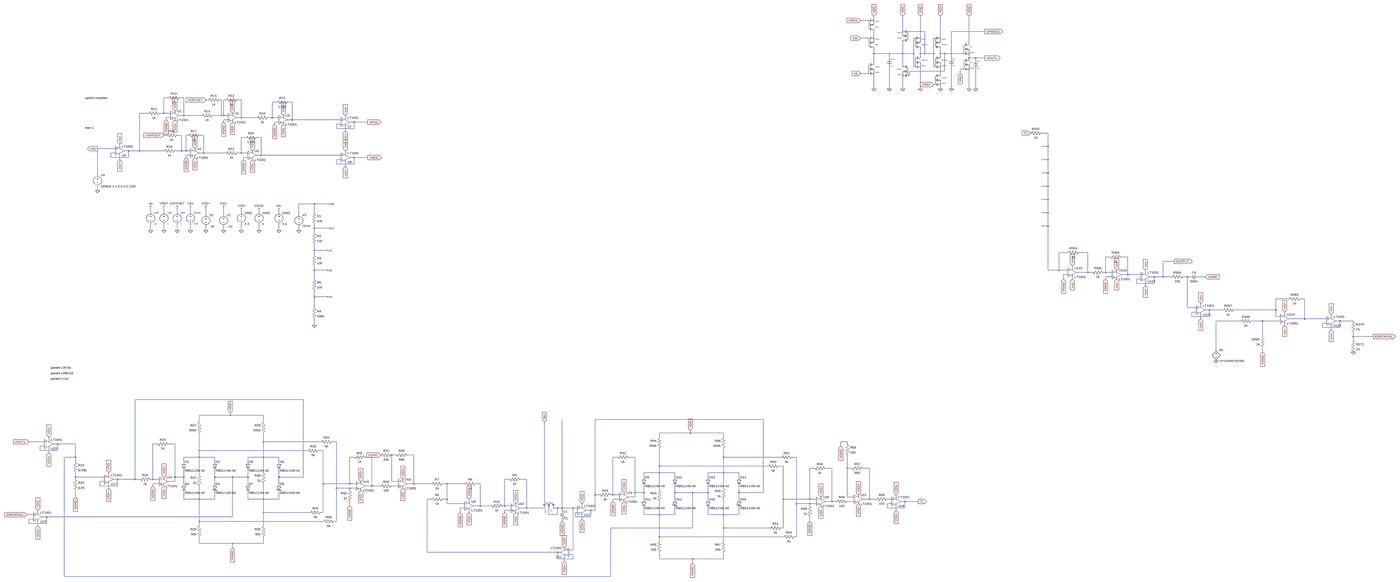
[diagram p0: schematic OZ_8_bounded_curves.asc, whole sheet]
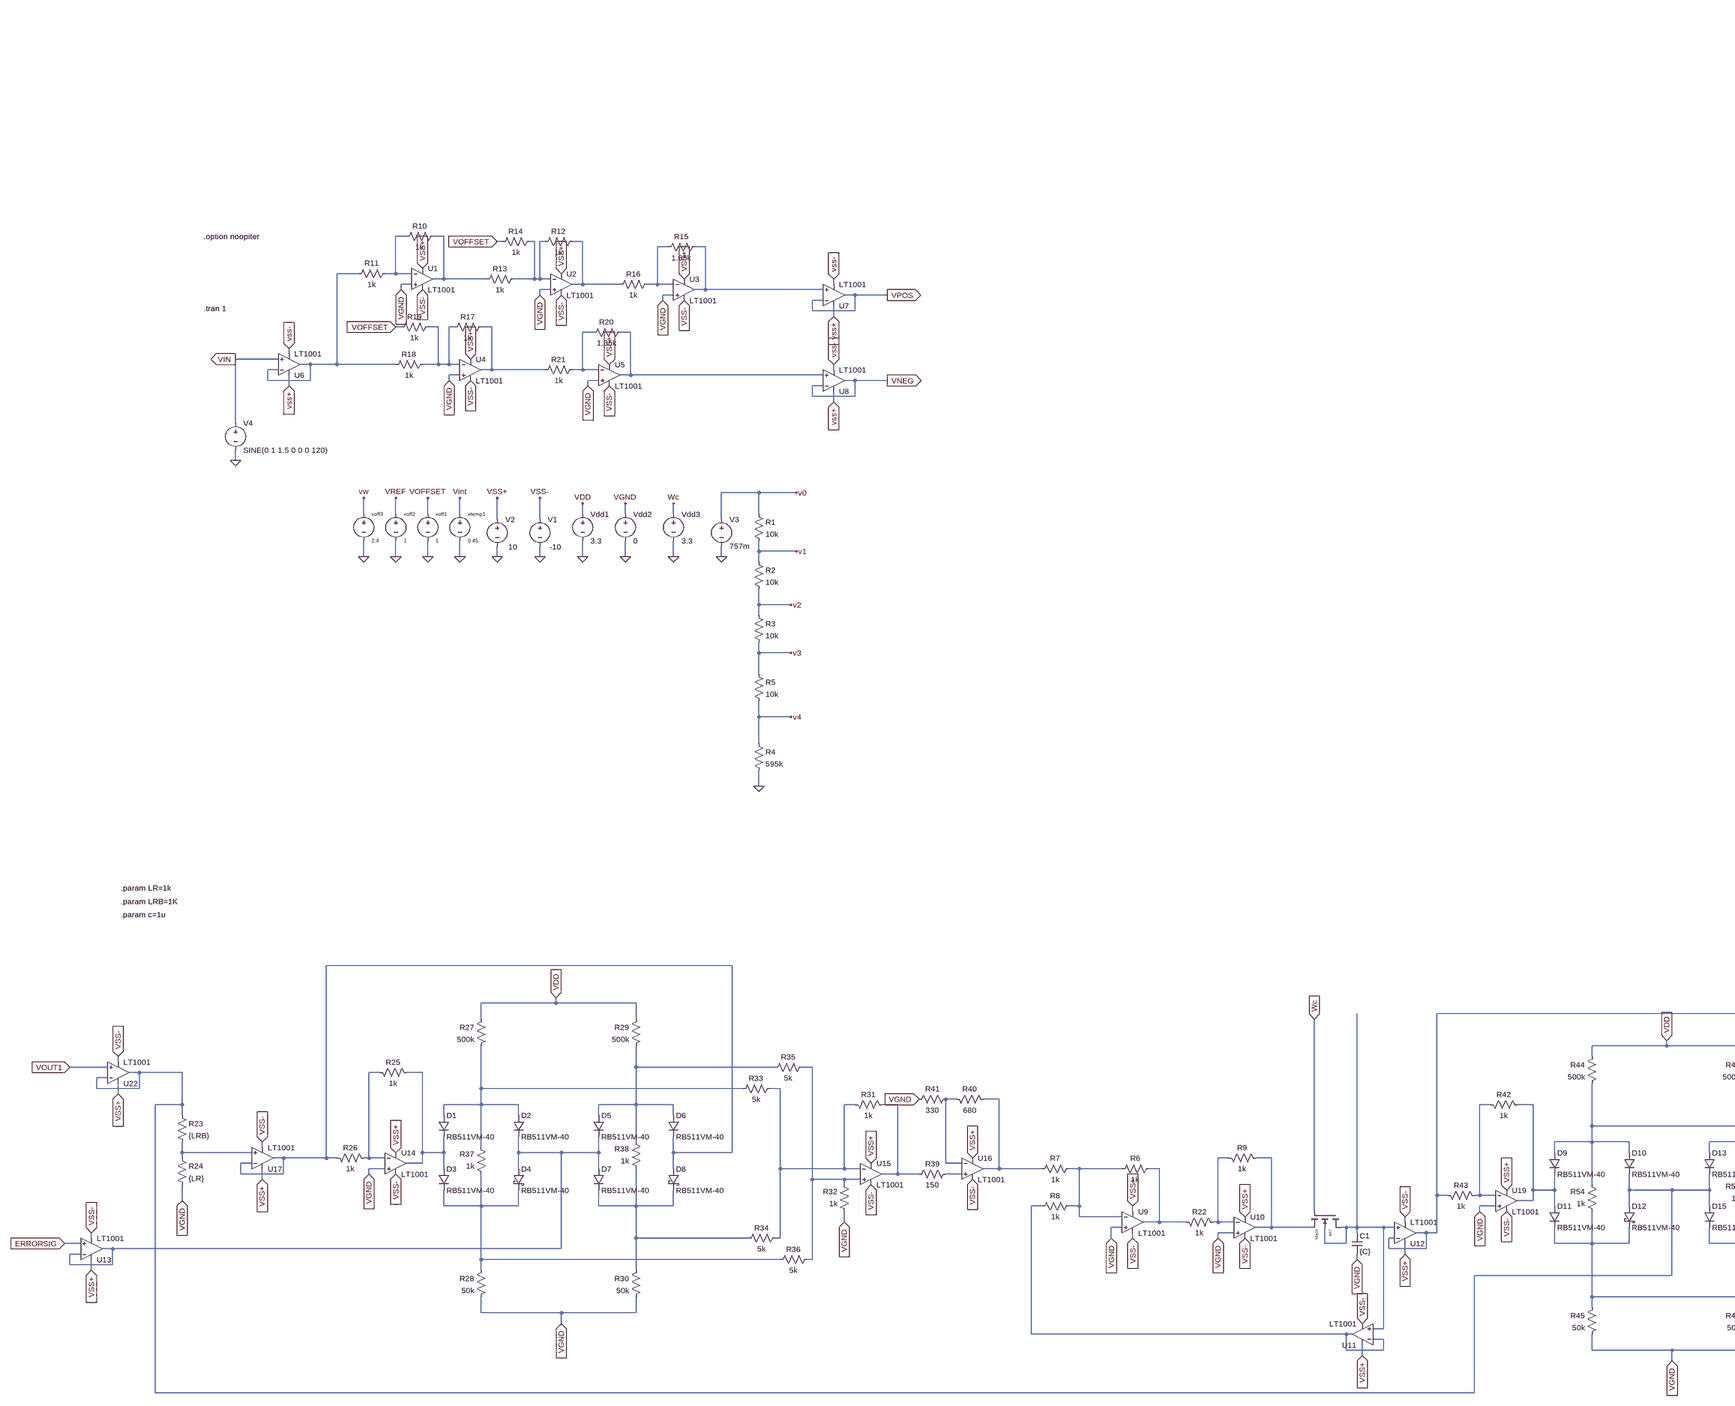
[diagram p1: schematic OZ_8_bounded_curves.asc, part, row 1 of 1, column 1 of 2]
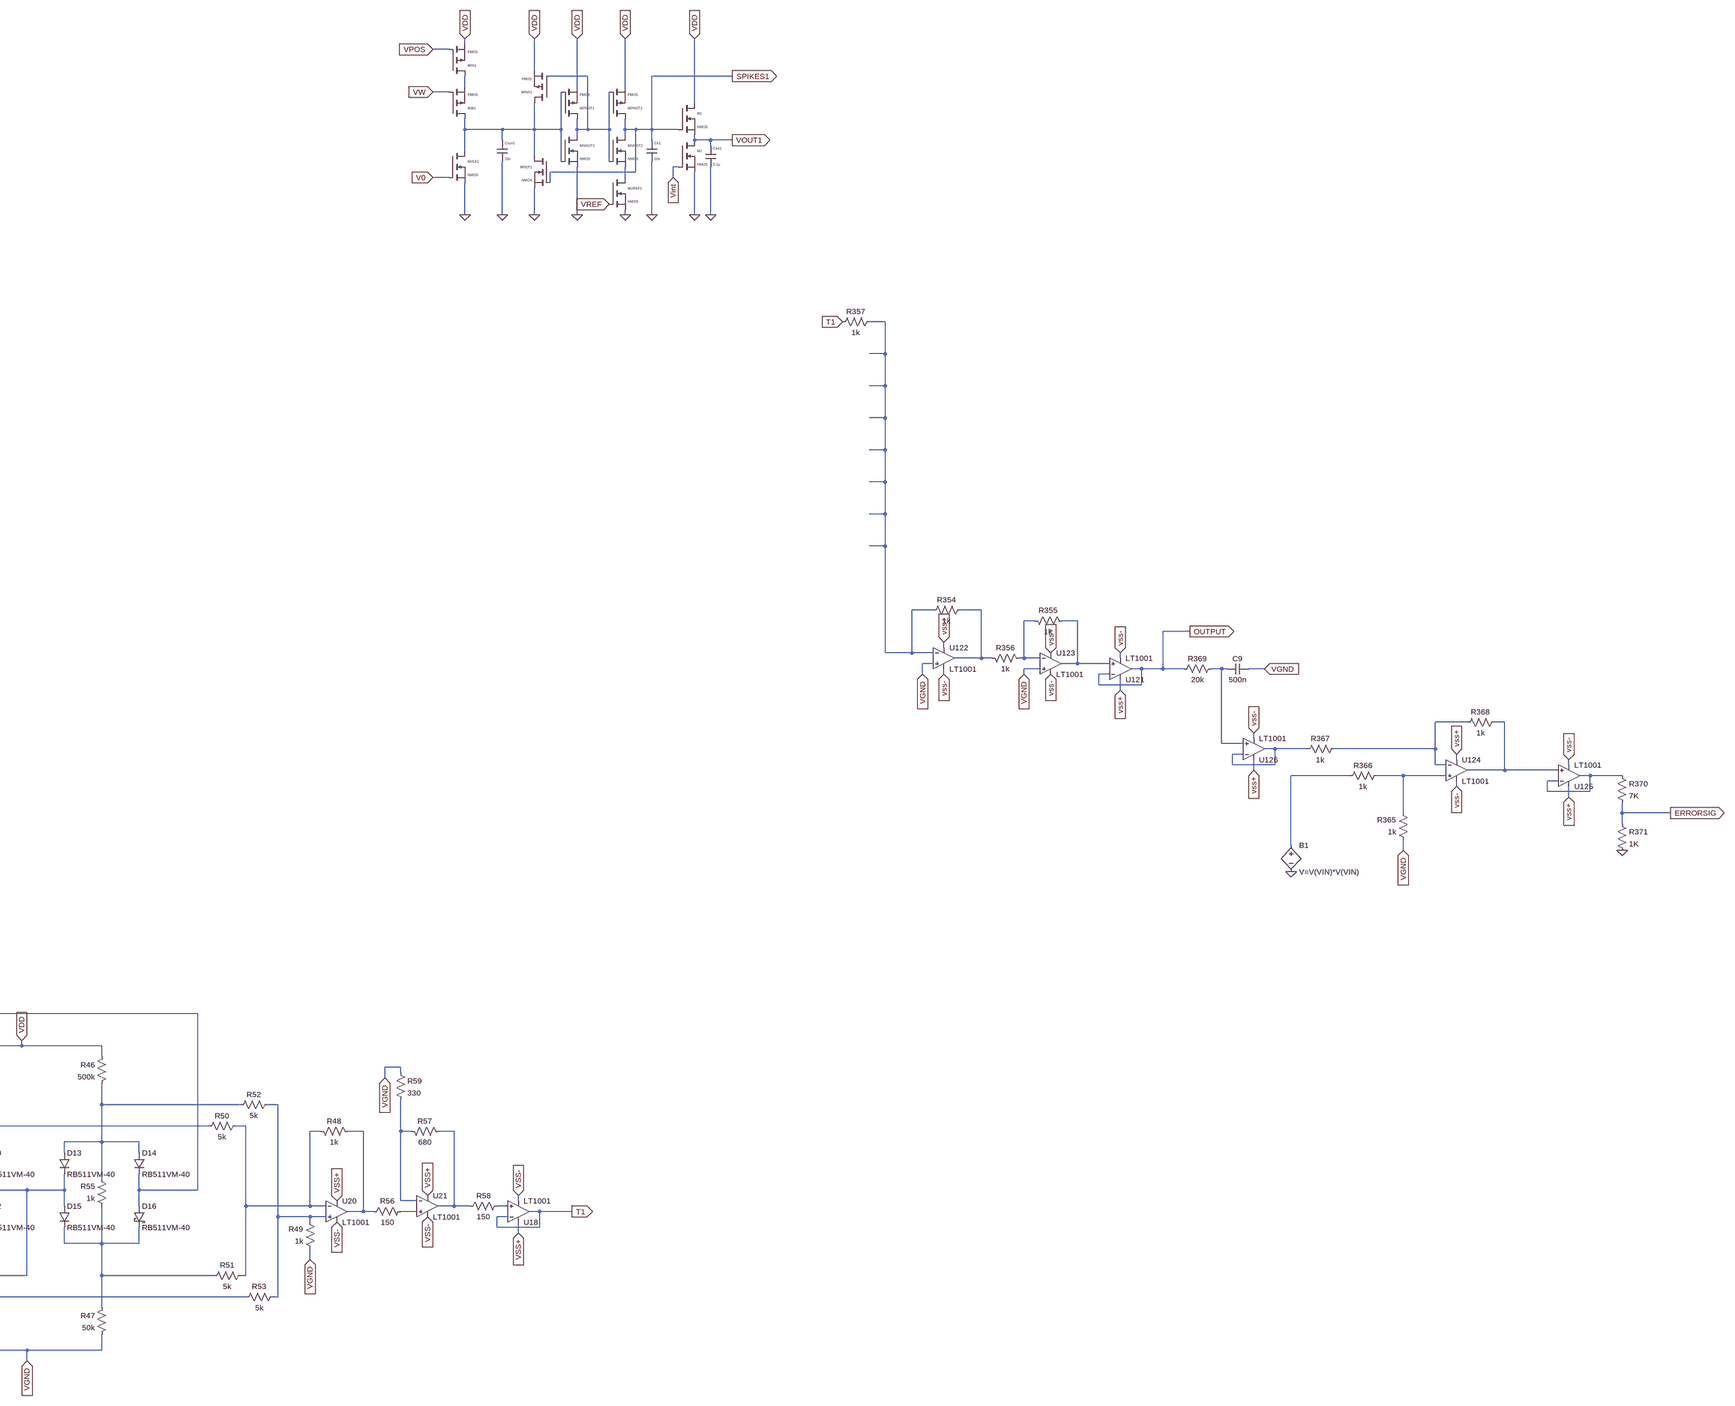
[diagram p2: schematic OZ_8_bounded_curves.asc, part, row 1 of 1, column 2 of 2]
OZ_8_bounded_curves.asc, the LTspice schematic file:
Version 4
SHEET 1 16040 10544
WIRE 5616 -832 5616 -848
WIRE 5568 -816 5520 -816
WIRE 5824 -752 5824 -848
WIRE 5984 -736 5872 -736
WIRE 6416 -736 6176 -736
WIRE 5616 -704 5616 -736
WIRE 5952 -704 5952 -848
WIRE 6096 -704 6096 -848
WIRE 5568 -688 5520 -688
WIRE 6304 -656 6304 -848
WIRE 5616 -576 5616 -608
WIRE 5728 -576 5616 -576
WIRE 5824 -576 5824 -656
WIRE 5824 -576 5728 -576
WIRE 5904 -576 5904 -688
WIRE 5904 -576 5824 -576
WIRE 5952 -576 5952 -608
WIRE 5984 -576 5984 -736
WIRE 5984 -576 5952 -576
WIRE 6048 -576 6048 -688
WIRE 6048 -576 5984 -576
WIRE 6096 -576 6096 -608
WIRE 6128 -576 6096 -576
WIRE 6176 -576 6176 -736
WIRE 6176 -576 6128 -576
WIRE 6256 -576 6176 -576
WIRE 5952 -560 5952 -576
WIRE 6096 -560 6096 -576
WIRE 5728 -544 5728 -576
WIRE 6176 -544 6176 -576
WIRE 6304 -544 6304 -560
WIRE 6352 -544 6304 -544
WIRE 6416 -544 6352 -544
WIRE 6304 -528 6304 -544
WIRE 6352 -528 6352 -544
WIRE 5616 -512 5616 -576
WIRE 5824 -496 5824 -576
WIRE 5904 -480 5904 -576
WIRE 6048 -480 6048 -576
WIRE 6256 -464 6240 -464
WIRE 6128 -448 6128 -576
WIRE 6128 -448 5872 -448
WIRE 5568 -432 5520 -432
WIRE 6096 -432 6096 -464
WIRE 6240 -432 6240 -464
WIRE 5872 -416 5872 -448
WIRE 5616 -320 5616 -416
WIRE 5728 -320 5728 -480
WIRE 5824 -320 5824 -400
WIRE 5952 -320 5952 -464
WIRE 6096 -320 6096 -336
WIRE 6176 -320 6176 -480
WIRE 6304 -320 6304 -448
WIRE 6352 -320 6352 -464
WIRE 512 -256 480 -256
WIRE 624 -256 592 -256
WIRE 800 -240 784 -240
WIRE 896 -240 880 -240
WIRE 928 -240 912 -240
WIRE 1040 -240 1008 -240
WIRE 1296 -224 1264 -224
WIRE 1408 -224 1376 -224
WIRE 368 -144 304 -144
WIRE 480 -144 480 -256
WIRE 480 -144 448 -144
WIRE 528 -144 480 -144
WIRE 624 -128 624 -256
WIRE 624 -128 592 -128
WIRE 752 -128 624 -128
WIRE 896 -128 896 -240
WIRE 896 -128 832 -128
WIRE 912 -128 912 -240
WIRE 912 -128 896 -128
WIRE 944 -128 912 -128
WIRE 528 -112 496 -112
WIRE 1040 -112 1040 -240
WIRE 1040 -112 1008 -112
WIRE 1152 -112 1040 -112
WIRE 1264 -112 1264 -224
WIRE 1264 -112 1232 -112
WIRE 1312 -112 1264 -112
WIRE 1792 -112 1792 -128
WIRE 496 -96 496 -112
WIRE 944 -96 912 -96
WIRE 1408 -96 1408 -224
WIRE 1408 -96 1376 -96
WIRE 1760 -96 1408 -96
WIRE 912 -80 912 -96
WIRE 1312 -80 1280 -80
WIRE 1856 -80 1824 -80
WIRE 1952 -80 1856 -80
WIRE 1280 -64 1280 -80
WIRE 1760 -64 1728 -64
WIRE 1728 -32 1728 -64
WIRE 1856 -32 1856 -80
WIRE 1856 -32 1728 -32
WIRE 1792 -16 1792 -48
WIRE 9216 0 9168 0
WIRE 496 16 480 16
WIRE 608 16 576 16
WIRE 656 16 640 16
WIRE 768 16 736 16
WIRE 1072 32 1040 32
WIRE 1184 32 1152 32
WIRE 160 96 160 80
WIRE 9216 96 9216 0
WIRE 9216 96 9168 96
WIRE 128 112 0 112
WIRE 224 128 192 128
WIRE 304 128 304 -144
WIRE 304 128 224 128
WIRE 480 128 304 128
WIRE 608 128 608 16
WIRE 608 128 560 128
WIRE 640 128 640 16
WIRE 640 128 608 128
WIRE 672 128 640 128
WIRE 128 144 96 144
WIRE 768 144 768 16
WIRE 768 144 736 144
WIRE 928 144 768 144
WIRE 1040 144 1040 32
WIRE 1040 144 1008 144
WIRE 1088 144 1040 144
WIRE 1792 144 1792 128
WIRE 672 160 640 160
WIRE 1184 160 1184 32
WIRE 1184 160 1152 160
WIRE 1760 160 1184 160
WIRE 96 176 96 144
WIRE 224 176 224 128
WIRE 224 176 96 176
WIRE 640 176 640 160
WIRE 1088 176 1056 176
WIRE 1856 176 1824 176
WIRE 1952 176 1856 176
WIRE 160 192 160 160
WIRE 1056 192 1056 176
WIRE 1760 192 1728 192
WIRE 9216 192 9216 96
WIRE 9216 192 9168 192
WIRE 1728 224 1728 192
WIRE 1856 224 1856 176
WIRE 1856 224 1728 224
WIRE 1792 240 1792 208
WIRE 9216 288 9216 192
WIRE 9216 288 9168 288
WIRE 0 304 0 112
WIRE 9216 384 9216 288
WIRE 9216 384 9168 384
WIRE 0 416 0 384
WIRE 9216 480 9216 384
WIRE 9216 480 9168 480
WIRE 1568 512 1456 512
WIRE 1680 512 1568 512
WIRE 384 576 384 528
WIRE 480 576 480 528
WIRE 576 576 576 528
WIRE 672 576 672 528
WIRE 1040 576 1040 544
WIRE 1168 576 1168 544
WIRE 1312 576 1312 544
WIRE 1568 576 1568 512
WIRE 9216 576 9216 480
WIRE 9216 576 9168 576
WIRE 784 592 784 528
WIRE 912 592 912 528
WIRE 1456 592 1456 512
WIRE 9216 672 9216 576
WIRE 9216 672 9168 672
WIRE 1568 688 1568 656
WIRE 1680 688 1568 688
WIRE 384 704 384 656
WIRE 480 704 480 656
WIRE 576 704 576 656
WIRE 672 704 672 656
WIRE 784 704 784 672
WIRE 912 704 912 672
WIRE 1040 704 1040 656
WIRE 1168 704 1168 656
WIRE 1312 704 1312 656
WIRE 1456 704 1456 672
WIRE 1568 720 1568 688
WIRE 1568 848 1568 800
WIRE 1664 848 1568 848
WIRE 9360 864 9296 864
WIRE 9504 864 9440 864
WIRE 1568 880 1568 848
WIRE 9664 896 9632 896
WIRE 9792 896 9744 896
WIRE 10128 928 10048 928
WIRE 9392 976 9392 960
WIRE 1568 992 1568 960
WIRE 1664 992 1568 992
WIRE 9216 992 9216 672
WIRE 9296 992 9296 864
WIRE 9296 992 9216 992
WIRE 9360 992 9296 992
WIRE 9504 1008 9504 864
WIRE 9504 1008 9424 1008
WIRE 9536 1008 9504 1008
WIRE 9632 1008 9632 896
WIRE 9632 1008 9616 1008
WIRE 9680 1008 9632 1008
WIRE 9920 1008 9920 992
WIRE 9360 1024 9328 1024
WIRE 9792 1024 9792 896
WIRE 9792 1024 9744 1024
WIRE 9888 1024 9792 1024
WIRE 9680 1040 9632 1040
WIRE 9984 1040 9952 1040
WIRE 10048 1040 10048 928
WIRE 10048 1040 9984 1040
WIRE 10112 1040 10048 1040
WIRE 10224 1040 10192 1040
WIRE 10240 1040 10224 1040
WIRE 10352 1040 10304 1040
WIRE 1568 1056 1568 992
WIRE 9328 1056 9328 1024
WIRE 9392 1056 9392 1040
WIRE 9632 1056 9632 1040
WIRE 9888 1056 9856 1056
WIRE 9856 1088 9856 1056
WIRE 9984 1088 9984 1040
WIRE 9984 1088 9856 1088
WIRE 9920 1104 9920 1072
WIRE 1568 1184 1568 1136
WIRE 1664 1184 1568 1184
WIRE 10960 1200 10864 1200
WIRE 11072 1200 11040 1200
WIRE 10320 1248 10320 1232
WIRE 1568 1264 1568 1184
WIRE 10224 1264 10224 1040
WIRE 10288 1264 10224 1264
WIRE 10384 1280 10352 1280
WIRE 10480 1280 10384 1280
WIRE 10864 1280 10864 1200
WIRE 10864 1280 10560 1280
WIRE 10288 1296 10256 1296
WIRE 10928 1312 10928 1296
WIRE 10256 1328 10256 1296
WIRE 10384 1328 10384 1280
WIRE 10384 1328 10256 1328
WIRE 10864 1328 10864 1280
WIRE 10896 1328 10864 1328
WIRE 11264 1328 11264 1312
WIRE 10320 1344 10320 1312
WIRE 11072 1344 11072 1200
WIRE 11072 1344 10960 1344
WIRE 11232 1344 11072 1344
WIRE 10608 1360 10432 1360
WIRE 10768 1360 10688 1360
WIRE 10896 1360 10768 1360
WIRE 11328 1360 11296 1360
WIRE 11424 1360 11328 1360
WIRE 11232 1376 11200 1376
WIRE 1568 1392 1568 1344
WIRE 10928 1392 10928 1376
WIRE 11200 1408 11200 1376
WIRE 11328 1408 11328 1360
WIRE 11328 1408 11200 1408
WIRE 11264 1424 11264 1392
WIRE 10768 1472 10768 1360
WIRE 11424 1472 11424 1440
WIRE 11568 1472 11424 1472
WIRE 11424 1504 11424 1472
WIRE 10432 1568 10432 1360
WIRE 10768 1584 10768 1552
WIRE 1488 4192 272 4192
WIRE 960 4304 960 4288
WIRE 960 4304 736 4304
WIRE 1200 4304 960 4304
WIRE 4816 4336 3600 4336
WIRE 736 4352 736 4304
WIRE 1200 4352 1200 4304
WIRE 4288 4432 4288 4416
WIRE 4288 4432 4064 4432
WIRE 4528 4432 4288 4432
WIRE 4064 4464 4064 4432
WIRE 4528 4464 4528 4432
WIRE -352 4480 -352 4464
WIRE -384 4496 -496 4496
WIRE 1200 4496 1200 4432
WIRE 1616 4496 1200 4496
WIRE 1728 4496 1696 4496
WIRE 5424 4496 5376 4496
WIRE -288 4512 -320 4512
WIRE -160 4512 -288 4512
WIRE 432 4512 400 4512
WIRE 560 4512 512 4512
WIRE 5424 4512 5424 4496
WIRE -384 4528 -416 4528
WIRE 5376 4528 5376 4496
WIRE -416 4560 -416 4528
WIRE -288 4560 -288 4512
WIRE -288 4560 -416 4560
WIRE 736 4560 736 4432
WIRE 1520 4560 736 4560
WIRE 1632 4560 1600 4560
WIRE -352 4576 -352 4544
WIRE 2160 4592 2128 4592
WIRE 2288 4592 2240 4592
WIRE -160 4608 -160 4512
WIRE -160 4608 -240 4608
WIRE 736 4608 736 4560
WIRE 736 4608 624 4608
WIRE 848 4608 736 4608
WIRE 1200 4608 1200 4496
WIRE 1200 4608 1088 4608
WIRE 1312 4608 1200 4608
WIRE 1856 4608 1824 4608
WIRE 1984 4608 1936 4608
WIRE 3760 4608 3728 4608
WIRE 3888 4608 3840 4608
WIRE 4528 4608 4528 4544
WIRE 4944 4608 4528 4608
WIRE 5056 4608 5024 4608
WIRE -160 4640 -160 4608
WIRE 624 4640 624 4608
WIRE 848 4640 848 4608
WIRE 1088 4640 1088 4608
WIRE 1312 4640 1312 4608
WIRE 4064 4672 4064 4544
WIRE 4848 4672 4064 4672
WIRE 4960 4672 4928 4672
WIRE 5184 4688 5152 4688
WIRE 5312 4688 5264 4688
WIRE 5424 4688 5424 4592
WIRE 5456 4688 5424 4688
WIRE 5584 4688 5536 4688
WIRE 1200 4720 1200 4608
WIRE 4064 4720 4064 4672
WIRE 4064 4720 3952 4720
WIRE 4176 4720 4064 4720
WIRE 4528 4720 4528 4608
WIRE 4528 4720 4416 4720
WIRE 4640 4720 4528 4720
WIRE 80 4736 80 4720
WIRE 736 4736 736 4608
WIRE -160 4752 -160 4720
WIRE 48 4752 -160 4752
WIRE 560 4752 560 4512
WIRE 624 4752 624 4704
WIRE 624 4752 560 4752
WIRE 848 4752 848 4704
WIRE 976 4752 848 4752
WIRE 1088 4752 1088 4704
WIRE 1088 4752 976 4752
WIRE 1312 4752 1312 4704
WIRE 1488 4752 1488 4192
WIRE 1488 4752 1312 4752
WIRE 3952 4752 3952 4720
WIRE 4176 4752 4176 4720
WIRE 4416 4752 4416 4720
WIRE 4640 4752 4640 4720
WIRE -160 4768 -160 4752
WIRE 144 4768 112 4768
WIRE 272 4768 272 4192
WIRE 272 4768 144 4768
WIRE 304 4768 272 4768
WIRE 400 4768 400 4512
WIRE 400 4768 384 4768
WIRE 448 4768 400 4768
WIRE 2976 4768 2944 4768
WIRE 3104 4768 3056 4768
WIRE 48 4784 16 4784
WIRE 560 4784 560 4752
WIRE 560 4784 512 4784
WIRE 2128 4784 2128 4592
WIRE 2176 4784 2128 4784
WIRE 448 4800 400 4800
WIRE 624 4800 624 4752
WIRE 848 4800 848 4752
WIRE 1088 4800 1088 4752
WIRE 1312 4800 1312 4752
WIRE 1632 4800 1632 4560
WIRE 1824 4800 1824 4608
WIRE 1824 4800 1632 4800
WIRE 1872 4800 1824 4800
WIRE 2288 4800 2288 4592
WIRE 2288 4800 2240 4800
WIRE 2416 4800 2288 4800
WIRE 2528 4800 2496 4800
WIRE 2656 4800 2528 4800
WIRE 2768 4800 2736 4800
WIRE 16 4816 16 4784
WIRE 144 4816 144 4768
WIRE 144 4816 16 4816
WIRE 400 4816 400 4800
WIRE 1984 4816 1984 4608
WIRE 1984 4816 1936 4816
WIRE 2048 4816 1984 4816
WIRE 2176 4816 2128 4816
WIRE 80 4832 80 4800
WIRE 1728 4832 1728 4496
WIRE 1824 4832 1728 4832
WIRE 1872 4832 1824 4832
WIRE 4528 4832 4528 4720
WIRE 1824 4848 1824 4832
WIRE 4064 4848 4064 4720
WIRE 3888 4864 3888 4608
WIRE 3952 4864 3952 4816
WIRE 3952 4864 3888 4864
WIRE 4176 4864 4176 4816
WIRE 4304 4864 4176 4864
WIRE 4416 4864 4416 4816
WIRE 4416 4864 4304 4864
WIRE 4640 4864 4640 4816
WIRE 4816 4864 4816 4336
WIRE 4816 4864 4640 4864
WIRE 3600 4880 3600 4336
WIRE 3632 4880 3600 4880
WIRE 3728 4880 3728 4608
WIRE 3728 4880 3712 4880
WIRE 3776 4880 3728 4880
WIRE -160 4896 -160 4848
WIRE 3888 4896 3888 4864
WIRE 3888 4896 3840 4896
WIRE 5424 4896 5424 4688
WIRE 5472 4896 5424 4896
WIRE 5776 4896 5776 4880
WIRE 624 4912 624 4864
WIRE 736 4912 736 4816
WIRE 736 4912 624 4912
WIRE 848 4912 848 4864
WIRE 848 4912 736 4912
WIRE 1088 4912 1088 4864
WIRE 1200 4912 1200 4800
WIRE 1200 4912 1088 4912
WIRE 1312 4912 1312 4864
WIRE 1312 4912 1200 4912
WIRE 2416 4912 2384 4912
WIRE 2528 4912 2528 4800
WIRE 2528 4912 2496 4912
WIRE 3776 4912 3728 4912
WIRE 3952 4912 3952 4864
WIRE 4176 4912 4176 4864
WIRE 4416 4912 4416 4864
WIRE 4640 4912 4640 4864
WIRE 4960 4912 4960 4672
WIRE 5152 4912 5152 4688
WIRE 5152 4912 4960 4912
WIRE 5200 4912 5152 4912
WIRE 5584 4912 5584 4688
WIRE 5584 4912 5536 4912
WIRE 5632 4912 5584 4912
WIRE 5744 4912 5712 4912
WIRE 2688 4928 2688 4912
WIRE 3232 4928 3232 4352
WIRE 3728 4928 3728 4912
WIRE 5312 4928 5312 4688
WIRE 5312 4928 5264 4928
WIRE 5344 4928 5312 4928
WIRE 5472 4928 5424 4928
WIRE 5840 4928 5808 4928
WIRE 5936 4928 5840 4928
WIRE 2528 4944 2528 4912
WIRE 2656 4944 2528 4944
WIRE 5056 4944 5056 4608
WIRE 5152 4944 5056 4944
WIRE 5200 4944 5152 4944
WIRE 5744 4944 5712 4944
WIRE 1824 4960 1824 4928
WIRE 2768 4960 2768 4800
WIRE 2768 4960 2720 4960
WIRE 2848 4960 2768 4960
WIRE 2944 4960 2944 4768
WIRE 2944 4960 2928 4960
WIRE 2992 4960 2944 4960
WIRE 3504 4960 3504 4944
WIRE 5152 4960 5152 4944
WIRE 2656 4976 2624 4976
WIRE 3104 4976 3104 4768
WIRE 3104 4976 3056 4976
WIRE 3216 4976 3104 4976
WIRE 3328 4976 3312 4976
WIRE 3360 4976 3360 4336
WIRE 3360 4976 3328 4976
WIRE 3440 4976 3360 4976
WIRE 3472 4976 3440 4976
WIRE 5712 4976 5712 4944
WIRE 5840 4976 5840 4928
WIRE 5840 4976 5712 4976
WIRE 2992 4992 2944 4992
WIRE 3360 4992 3360 4976
WIRE 3568 4992 3536 4992
WIRE 3600 4992 3600 4880
WIRE 3600 4992 3568 4992
WIRE 5776 4992 5776 4960
WIRE -432 5008 -432 4992
WIRE 1200 5008 1200 4912
WIRE 1536 5008 1200 5008
WIRE 1632 5008 1632 4800
WIRE 1632 5008 1616 5008
WIRE 2624 5008 2624 4976
WIRE 2688 5008 2688 4992
WIRE 2944 5008 2944 4992
WIRE 3472 5008 3456 5008
WIRE -464 5024 -512 5024
WIRE 3264 5024 3264 4976
WIRE 3328 5024 3328 4976
WIRE 3328 5024 3264 5024
WIRE 3952 5024 3952 4976
WIRE 4064 5024 4064 4928
WIRE 4064 5024 3952 5024
WIRE 4176 5024 4176 4976
WIRE 4176 5024 4064 5024
WIRE 4416 5024 4416 4976
WIRE 4528 5024 4528 4912
WIRE 4528 5024 4416 5024
WIRE 4640 5024 4640 4976
WIRE 4640 5024 4528 5024
WIRE -368 5040 -400 5040
WIRE 976 5040 976 4752
WIRE 976 5040 -368 5040
WIRE 3456 5040 3456 5008
WIRE 3568 5040 3568 4992
WIRE 3568 5040 3456 5040
WIRE -464 5056 -496 5056
WIRE 3504 5056 3504 5024
WIRE 736 5072 736 4912
WIRE 1632 5072 736 5072
WIRE 1728 5072 1728 4832
WIRE 1728 5072 1712 5072
WIRE 3360 5072 3360 5056
WIRE 5152 5072 5152 5040
WIRE -496 5088 -496 5056
WIRE -368 5088 -368 5040
WIRE -368 5088 -496 5088
WIRE -432 5104 -432 5072
WIRE 736 5104 736 5072
WIRE 1200 5104 1200 5008
WIRE 4304 5120 4304 4864
WIRE 4304 5120 3712 5120
WIRE 4528 5120 4528 5024
WIRE 4864 5120 4528 5120
WIRE 4960 5120 4960 4912
WIRE 4960 5120 4944 5120
WIRE 4064 5184 4064 5024
WIRE 4960 5184 4064 5184
WIRE 5056 5184 5056 4944
WIRE 5056 5184 5040 5184
WIRE 4064 5216 4064 5184
WIRE 4528 5216 4528 5120
WIRE 736 5232 736 5184
WIRE 976 5232 736 5232
WIRE 1200 5232 1200 5184
WIRE 1200 5232 976 5232
WIRE 976 5264 976 5232
WIRE 3440 5280 3440 4976
WIRE 3440 5280 3408 5280
WIRE 2384 5296 2384 4912
WIRE 3328 5296 2384 5296
WIRE 3344 5296 3328 5296
WIRE 3440 5312 3408 5312
WIRE 3328 5344 3328 5296
WIRE 3440 5344 3440 5312
WIRE 3440 5344 3328 5344
WIRE 4064 5344 4064 5296
WIRE 4304 5344 4064 5344
WIRE 4528 5344 4528 5296
WIRE 4528 5344 4304 5344
WIRE 3376 5360 3376 5328
WIRE 4304 5376 4304 5344
WIRE -240 5472 -240 4608
WIRE 3712 5472 3712 5120
WIRE 3712 5472 -240 5472
FLAG 672 704 0
FLAG 672 528 Vint
FLAG 1040 544 VDD
FLAG 1040 704 0
FLAG 912 704 0
FLAG 912 528 VSS-
FLAG 784 704 0
FLAG 784 528 VSS+
FLAG 576 704 0
FLAG 576 528 VOFFSET
FLAG 480 704 0
FLAG 480 528 VREF
FLAG 384 704 0
FLAG 384 528 vw
FLAG 1168 544 VGND
FLAG 1168 704 0
FLAG 0 416 0
FLAG 1952 -80 VPOS
IOPIN 1952 -80 Out
FLAG 1952 176 VNEG
IOPIN 1952 176 Out
FLAG 1056 192 VGND
IOPIN 1056 192 In
FLAG 640 176 VGND
IOPIN 640 176 In
FLAG 496 -96 VGND
IOPIN 496 -96 In
FLAG 912 -80 VGND
IOPIN 912 -80 In
FLAG 1280 -64 VGND
IOPIN 1280 -64 In
FLAG 1344 -128 VSS+
IOPIN 1344 -128 In
FLAG 976 -144 VSS+
IOPIN 976 -144 In
FLAG 560 -160 VSS+
IOPIN 560 -160 In
FLAG 704 112 VSS+
IOPIN 704 112 In
FLAG 1120 128 VSS+
IOPIN 1120 128 In
FLAG 1344 -64 VSS-
IOPIN 1344 -64 In
FLAG 976 -80 VSS-
IOPIN 976 -80 In
FLAG 560 -96 VSS-
IOPIN 560 -96 In
FLAG 704 176 VSS-
IOPIN 704 176 In
FLAG 1120 192 VSS-
IOPIN 1120 192 In
FLAG 784 -240 VOFFSET
IOPIN 784 -240 In
FLAG 480 16 VOFFSET
IOPIN 480 16 In
FLAG 160 192 vss+
IOPIN 160 192 In
FLAG 160 80 vss-
IOPIN 160 80 In
FLAG 1792 -16 vss+
IOPIN 1792 -16 In
FLAG 1792 -128 vss-
IOPIN 1792 -128 In
FLAG 1792 240 vss+
IOPIN 1792 240 In
FLAG 1792 128 vss-
IOPIN 1792 128 In
FLAG 5952 -848 VDD
IOPIN 5952 -848 In
FLAG 5520 -816 VPOS
IOPIN 5520 -816 In
FLAG 5520 -688 VW
IOPIN 5520 -688 In
FLAG 5520 -432 V0
IOPIN 5520 -432 In
FLAG 6048 -352 VREF
IOPIN 6048 -352 In
FLAG 6240 -432 Vint
IOPIN 6240 -432 In
FLAG 6416 -544 VOUT1
IOPIN 6416 -544 Out
FLAG 5616 -320 0
FLAG 5728 -320 0
FLAG 5824 -320 0
FLAG 5952 -320 0
FLAG 6096 -320 0
FLAG 6176 -320 0
FLAG 6304 -320 0
FLAG 6352 -320 0
FLAG 5824 -848 VDD
IOPIN 5824 -848 In
FLAG 5616 -848 VDD
IOPIN 5616 -848 In
FLAG 6304 -848 VDD
IOPIN 6304 -848 In
FLAG 6096 -848 VDD
IOPIN 6096 -848 In
FLAG 6416 -736 SPIKES1
IOPIN 6416 -736 Out
FLAG 1456 704 0
FLAG 1680 688 v1
FLAG 1664 848 v2
FLAG 1664 992 v3
FLAG 1664 1184 v4
FLAG 1568 1392 0
FLAG 1680 512 v0
FLAG 9920 1104 vss+
IOPIN 9920 1104 In
FLAG 9920 992 vss-
IOPIN 9920 992 In
FLAG 9392 960 vss+
IOPIN 9392 960 In
FLAG 9392 1056 vss-
IOPIN 9392 1056 In
FLAG 9328 1056 VGND
IOPIN 9328 1056 In
FLAG 9712 992 vss+
IOPIN 9712 992 In
FLAG 9712 1056 vss-
IOPIN 9712 1056 In
FLAG 9632 1056 VGND
IOPIN 9632 1056 In
FLAG 9088 0 T1
IOPIN 9088 0 In
FLAG -496 4496 VOUT1
IOPIN -496 4496 In
FLAG 5936 4928 T1
IOPIN 5936 4928 Out
FLAG 400 4816 VGND
IOPIN 400 4816 In
FLAG 976 5264 VGND
IOPIN 976 5264 In
FLAG 1824 4960 VGND
IOPIN 1824 4960 In
FLAG 2624 5008 VGND
IOPIN 2624 5008 In
FLAG 2944 5008 VGND
IOPIN 2944 5008 In
FLAG 3360 5072 VGND
IOPIN 3360 5072 In
FLAG 3728 4928 VGND
IOPIN 3728 4928 In
FLAG 4304 5376 VGND
IOPIN 4304 5376 In
FLAG 5152 5072 VGND
IOPIN 5152 5072 In
FLAG 5376 4528 VGND
IOPIN 5376 4528 In
FLAG 2048 4592 VGND
IOPIN 2048 4592 In
FLAG 4288 4416 VDD
IOPIN 4288 4416 In
FLAG -160 4896 VGND
IOPIN -160 4896 In
FLAG -432 5104 VSS+
IOPIN -432 5104 In
FLAG 80 4832 VSS+
IOPIN 80 4832 In
FLAG 480 4752 VSS+
IOPIN 480 4752 In
FLAG 1904 4784 VSS+
IOPIN 1904 4784 In
FLAG 2208 4768 VSS+
IOPIN 2208 4768 In
FLAG 2688 4912 VSS+
IOPIN 2688 4912 In
FLAG 3024 4944 VSS+
IOPIN 3024 4944 In
FLAG 3808 4864 VSS+
IOPIN 3808 4864 In
FLAG 5232 4896 VSS+
IOPIN 5232 4896 In
FLAG 5504 4880 VSS+
IOPIN 5504 4880 In
FLAG 5776 4992 VSS+
IOPIN 5776 4992 In
FLAG 3376 5360 VSS+
IOPIN 3376 5360 In
FLAG 80 4720 VSS-
IOPIN 80 4720 In
FLAG -432 4992 VSS-
IOPIN -432 4992 In
FLAG 480 4816 VSS-
IOPIN 480 4816 In
FLAG 1904 4848 VSS-
IOPIN 1904 4848 In
FLAG 2688 5008 VSS-
IOPIN 2688 5008 In
FLAG 3024 5008 VSS-
IOPIN 3024 5008 In
FLAG 3504 4944 VSS-
IOPIN 3504 4944 In
FLAG 5232 4960 VSS-
IOPIN 5232 4960 In
FLAG 5504 4944 VSS-
IOPIN 5504 4944 In
FLAG 5776 4880 VSS-
IOPIN 5776 4880 In
FLAG 3504 5056 VSS+
IOPIN 3504 5056 In
FLAG 3376 5264 VSS-
IOPIN 3376 5264 In
FLAG 3808 4928 VSS-
IOPIN 3808 4928 In
FLAG 2208 4832 VSS-
IOPIN 2208 4832 In
FLAG 3232 4352 Wc
IOPIN 3232 4352 In
FLAG -512 5024 ERRORSIG
IOPIN -512 5024 In
FLAG 960 4288 VDD
IOPIN 960 4288 In
FLAG -352 4576 VSS+
IOPIN -352 4576 In
FLAG -352 4464 VSS-
IOPIN -352 4464 In
FLAG 10768 1584 VGND
IOPIN 10768 1584 In
FLAG 10928 1392 vss-
IOPIN 10928 1392 In
FLAG 10928 1296 vss+
IOPIN 10928 1296 In
FLAG 11264 1424 vss+
IOPIN 11264 1424 In
FLAG 11264 1312 vss-
IOPIN 11264 1312 In
FLAG 10352 1040 VGND
IOPIN 10352 1040 In
FLAG 10320 1344 vss+
IOPIN 10320 1344 In
FLAG 10320 1232 vss-
IOPIN 10320 1232 In
FLAG 11424 1584 0
FLAG 11568 1472 ERRORSIG
IOPIN 11568 1472 Out
FLAG 1312 544 Wc
FLAG 1312 704 0
FLAG 0 112 VIN
IOPIN 0 112 Out
FLAG 10128 928 OUTPUT
IOPIN 10128 928 Out
FLAG 10432 1648 0
SYMBOL voltage 672 560 R0
WINDOW 123 0 0 Left 0
WINDOW 39 0 0 Left 0
WINDOW 0 24 16 Left 1
WINDOW 3 24 96 Left 1
SYMATTR InstName vtemp1
SYMATTR Value 0.45
SYMBOL voltage 1040 560 R0
WINDOW 123 0 0 Left 0
WINDOW 39 0 0 Left 0
SYMATTR InstName Vdd1
SYMATTR Value 3.3
SYMBOL voltage 912 576 R0
WINDOW 3 47 82 Top 2
WINDOW 123 0 0 Left 0
WINDOW 39 0 0 Left 0
SYMATTR Value -10
SYMATTR InstName V1
SYMBOL voltage 784 576 R0
WINDOW 3 47 82 Top 2
WINDOW 123 0 0 Left 0
WINDOW 39 0 0 Left 0
SYMATTR Value 10
SYMATTR InstName V2
SYMBOL voltage 576 560 R0
WINDOW 123 0 0 Left 0
WINDOW 39 0 0 Left 0
WINDOW 0 24 16 Left 1
WINDOW 3 24 96 Left 1
SYMATTR InstName voff1
SYMATTR Value 1
SYMBOL voltage 480 560 R0
WINDOW 123 0 0 Left 0
WINDOW 39 0 0 Left 0
WINDOW 0 24 16 Left 1
WINDOW 3 24 96 Left 1
SYMATTR InstName voff2
SYMATTR Value 1
SYMBOL voltage 384 560 R0
WINDOW 123 0 0 Left 0
WINDOW 39 0 0 Left 0
WINDOW 0 24 16 Left 1
WINDOW 3 24 96 Left 1
SYMATTR InstName voff3
SYMATTR Value 2.4
SYMBOL voltage 1168 560 R0
WINDOW 123 0 0 Left 0
WINDOW 39 0 0 Left 0
SYMATTR InstName Vdd2
SYMATTR Value 0
SYMBOL OpAmps\\LT1001 560 -192 R0
SYMATTR InstName U1
SYMBOL res 608 -272 R90
WINDOW 0 0 56 VBottom 2
WINDOW 3 32 56 VTop 2
SYMATTR InstName R10
SYMATTR Value 1k
SYMBOL res 464 -160 R90
WINDOW 0 0 56 VBottom 2
WINDOW 3 32 56 VTop 2
SYMATTR InstName R11
SYMATTR Value 1k
SYMBOL OpAmps\\LT1001 976 -176 R0
SYMATTR InstName U2
SYMBOL res 1024 -256 R90
WINDOW 0 0 56 VBottom 2
WINDOW 3 32 56 VTop 2
SYMATTR InstName R12
SYMATTR Value 1k
SYMBOL res 848 -144 R90
WINDOW 0 0 56 VBottom 2
WINDOW 3 32 56 VTop 2
SYMATTR InstName R13
SYMATTR Value 1k
SYMBOL res 896 -256 R90
WINDOW 0 0 56 VBottom 2
WINDOW 3 32 56 VTop 2
SYMATTR InstName R14
SYMATTR Value 1k
SYMBOL OpAmps\\LT1001 1344 -160 R0
SYMATTR InstName U3
SYMBOL res 1392 -240 R90
WINDOW 0 0 56 VBottom 2
WINDOW 3 32 56 VTop 2
SYMATTR InstName R15
SYMATTR Value 1.65k
SYMBOL res 1248 -128 R90
WINDOW 0 0 56 VBottom 2
WINDOW 3 32 56 VTop 2
SYMATTR InstName R16
SYMATTR Value 1k
SYMBOL OpAmps\\LT1001 704 80 R0
SYMATTR InstName U4
SYMBOL res 752 0 R90
WINDOW 0 0 56 VBottom 2
WINDOW 3 32 56 VTop 2
SYMATTR InstName R17
SYMATTR Value 1k
SYMBOL res 576 112 R90
WINDOW 0 0 56 VBottom 2
WINDOW 3 32 56 VTop 2
SYMATTR InstName R18
SYMATTR Value 1k
SYMBOL res 592 0 R90
WINDOW 0 0 56 VBottom 2
WINDOW 3 32 56 VTop 2
SYMATTR InstName R19
SYMATTR Value 1k
SYMBOL OpAmps\\LT1001 1120 96 R0
SYMATTR InstName U5
SYMBOL res 1168 16 R90
WINDOW 0 0 56 VBottom 2
WINDOW 3 32 56 VTop 2
SYMATTR InstName R20
SYMATTR Value 1.65k
SYMBOL res 1024 128 R90
WINDOW 0 0 56 VBottom 2
WINDOW 3 32 56 VTop 2
SYMATTR InstName R21
SYMATTR Value 1k
SYMBOL OpAmps\\LT1001 160 192 M180
SYMATTR InstName U6
SYMBOL OpAmps\\LT1001 1792 -16 M180
SYMATTR InstName U7
SYMBOL OpAmps\\LT1001 1792 240 M180
SYMATTR InstName U8
SYMBOL pmos 5568 -608 M180
WINDOW 0 56 32 Left 0
WINDOW 3 56 72 Left 0
SYMATTR InstName MW1
SYMBOL cap 5712 -544 R0
WINDOW 0 24 8 Left 0
WINDOW 3 24 56 Left 0
SYMATTR InstName Csyn1
SYMATTR Value 10n
SYMATTR SpiceLine V=4 Irms=162m Rser=0.395426 Lser=0 mfg="KEMET" pn="C0402C103K7PAC" type="X5R" IC=0
SYMBOL cap 6160 -544 R0
WINDOW 0 24 8 Left 0
WINDOW 3 24 56 Left 0
SYMATTR InstName Ck1
SYMATTR Value 10n
SYMBOL pmos 5904 -608 M180
WINDOW 0 56 32 Left 0
WINDOW 3 56 72 Left 0
SYMATTR InstName MPNOT1
SYMBOL nmos 5904 -560 R0
WINDOW 0 56 32 Left 0
WINDOW 3 56 72 Left 0
SYMATTR InstName MNNOT1
SYMBOL nmos 6048 -432 R0
WINDOW 0 56 32 Left 0
WINDOW 3 56 72 Left 0
SYMATTR InstName MVREF1
SYMBOL nmos 5872 -496 M0
WINDOW 0 56 32 Left 0
WINDOW 3 56 72 Left 0
SYMATTR InstName MREF1
SYMBOL nmos 5568 -512 R0
WINDOW 0 56 32 Left 0
WINDOW 3 56 72 Left 0
SYMATTR InstName MVLK1
SYMBOL pmos 5872 -656 R180
WINDOW 0 56 32 Left 0
WINDOW 3 56 72 Left 0
SYMATTR InstName MINA1
SYMBOL pmos 5568 -736 M180
WINDOW 0 56 32 Left 0
WINDOW 3 56 72 Left 0
SYMATTR InstName MIN1
SYMBOL pmos 6048 -608 M180
WINDOW 0 56 32 Left 0
WINDOW 3 56 72 Left 0
SYMATTR InstName MPNOT2
SYMBOL nmos 6048 -560 R0
WINDOW 0 56 32 Left 0
WINDOW 3 56 72 Left 0
SYMATTR InstName MNNOT2
SYMBOL nmos 6256 -656 R0
WINDOW 0 56 32 Left 0
WINDOW 3 56 72 Left 0
SYMATTR InstName M1
SYMBOL nmos 6256 -544 R0
WINDOW 0 56 32 Left 0
WINDOW 3 56 72 Left 0
SYMATTR InstName M2
SYMBOL cap 6336 -528 R0
WINDOW 0 24 8 Left 0
WINDOW 3 24 56 Left 0
SYMATTR InstName Cint1
SYMATTR Value 0.1µ
SYMBOL voltage 1456 576 R0
SYMATTR InstName V3
SYMATTR Value 757m
SYMBOL res 1552 560 R0
SYMATTR InstName R1
SYMATTR Value 10k
SYMBOL res 1552 704 R0
SYMATTR InstName R2
SYMATTR Value 10k
SYMBOL res 1552 864 R0
SYMATTR InstName R3
SYMATTR Value 10k
SYMBOL res 1552 1248 R0
SYMATTR InstName R4
SYMATTR Value 595k
SYMBOL res 1552 1040 R0
SYMATTR InstName R5
SYMATTR Value 10k
SYMBOL voltage 0 288 R0
WINDOW 123 0 0 Left 0
WINDOW 39 0 0 Left 0
SYMATTR InstName V4
SYMATTR Value SINE(0 1 1.5 0 0 0 120)
SYMBOL OpAmps\\LT1001 9920 1104 M180
SYMATTR InstName U121
SYMBOL OpAmps\\LT1001 9392 944 R0
SYMATTR InstName U122
SYMBOL res 9456 848 R90
WINDOW 0 0 56 VBottom 2
WINDOW 3 32 56 VTop 2
SYMATTR InstName R354
SYMATTR Value 1k
SYMBOL OpAmps\\LT1001 9712 960 R0
SYMATTR InstName U123
SYMBOL res 9648 880 M90
WINDOW 0 0 56 VBottom 2
WINDOW 3 32 56 VTop 2
SYMATTR InstName R355
SYMATTR Value 1k
SYMBOL res 9520 992 M90
WINDOW 0 0 56 VBottom 2
WINDOW 3 32 56 VTop 2
SYMATTR InstName R356
SYMATTR Value 1k
SYMBOL res 9184 -16 R90
WINDOW 0 0 56 VBottom 2
WINDOW 3 32 56 VTop 2
SYMATTR InstName R357
SYMATTR Value 1k
SYMBOL nmos4 3312 4928 R90
WINDOW 0 56 32 Left 0
WINDOW 3 56 72 Left 0
SYMATTR InstName M17
SYMBOL cap 3344 4992 R0
SYMATTR InstName C1
SYMATTR Value {C}
SYMATTR SpiceLine IC=0
SYMBOL OpAmps\\LT1001 2688 4896 R0
SYMATTR InstName U9
SYMBOL res 2752 4784 R90
WINDOW 0 0 56 VBottom 2
WINDOW 3 32 56 VTop 2
SYMATTR InstName R6
SYMATTR Value 1k
SYMBOL res 2512 4784 R90
WINDOW 0 0 56 VBottom 2
WINDOW 3 32 56 VTop 2
SYMATTR InstName R7
SYMATTR Value 1k
SYMBOL res 2512 4896 R90
WINDOW 0 0 56 VBottom 2
WINDOW 3 32 56 VTop 2
SYMATTR InstName R8
SYMATTR Value 1k
SYMBOL OpAmps\\LT1001 3024 4912 R0
SYMATTR InstName U10
SYMBOL res 2960 4752 M90
WINDOW 0 0 56 VBottom 2
WINDOW 3 32 56 VTop 2
SYMATTR InstName R9
SYMATTR Value 1k
SYMBOL res 2832 4944 M90
WINDOW 0 0 56 VBottom 2
WINDOW 3 32 56 VTop 2
SYMATTR InstName R22
SYMATTR Value 1k
SYMBOL OpAmps\\LT1001 3376 5360 R180
SYMATTR InstName U11
SYMBOL OpAmps\\LT1001 3504 5056 M180
SYMATTR InstName U12
SYMBOL res -176 4624 R0
SYMATTR InstName R23
SYMATTR Value {LRB}
SYMBOL res -176 4752 R0
SYMATTR InstName R24
SYMATTR Value {LR}
SYMBOL OpAmps\\LT1001 -432 5104 M180
SYMATTR InstName U13
SYMBOL diode 608 4640 R0
SYMATTR InstName D1
SYMATTR Value RB511VM-40
SYMBOL OpAmps\\LT1001 480 4720 R0
SYMATTR InstName U14
SYMBOL res 416 4496 M90
WINDOW 0 0 56 VBottom 2
WINDOW 3 32 56 VTop 2
SYMATTR InstName R25
SYMATTR Value 1k
SYMBOL res 288 4752 M90
WINDOW 0 0 56 VBottom 2
WINDOW 3 32 56 VTop 2
SYMATTR InstName R26
SYMATTR Value 1k
SYMBOL diode 832 4640 R0
SYMATTR InstName D2
SYMATTR Value RB511VM-40
SYMBOL diode 608 4800 R0
SYMATTR InstName D3
SYMATTR Value RB511VM-40
SYMBOL schottky 832 4800 R0
SYMATTR InstName D4
SYMATTR Value RB511VM-40
SYMATTR Description Diode
SYMATTR Type diode
SYMBOL res 752 4336 M0
SYMATTR InstName R27
SYMATTR Value 500k
SYMBOL res 752 5088 M0
SYMATTR InstName R28
SYMATTR Value 50k
SYMBOL diode 1072 4640 R0
SYMATTR InstName D5
SYMATTR Value RB511VM-40
SYMBOL diode 1296 4640 R0
SYMATTR InstName D6
SYMATTR Value RB511VM-40
SYMBOL diode 1072 4800 R0
SYMATTR InstName D7
SYMATTR Value RB511VM-40
SYMBOL schottky 1296 4800 R0
SYMATTR InstName D8
SYMATTR Value RB511VM-40
SYMATTR Description Diode
SYMATTR Type diode
SYMBOL res 1216 4336 M0
SYMATTR InstName R29
SYMATTR Value 500k
SYMBOL res 1216 5088 M0
SYMATTR InstName R30
SYMATTR Value 50k
SYMBOL OpAmps\\LT1001 1904 4752 R0
SYMATTR InstName U15
SYMBOL res 1840 4592 M90
WINDOW 0 0 56 VBottom 2
WINDOW 3 32 56 VTop 2
SYMATTR InstName R31
SYMATTR Value 1k
SYMBOL res 1840 4944 R180
WINDOW 0 36 76 Left 2
WINDOW 3 36 40 Left 2
SYMATTR InstName R32
SYMATTR Value 1k
SYMBOL res 1616 4544 R90
WINDOW 0 0 56 VBottom 2
WINDOW 3 32 56 VTop 2
SYMATTR InstName R33
SYMATTR Value 5k
SYMBOL res 1632 4992 R90
WINDOW 0 0 56 VBottom 2
WINDOW 3 32 56 VTop 2
SYMATTR InstName R34
SYMATTR Value 5k
SYMBOL res 1712 4480 R90
WINDOW 0 0 56 VBottom 2
WINDOW 3 32 56 VTop 2
SYMATTR InstName R35
SYMATTR Value 5k
SYMBOL res 1728 5056 R90
WINDOW 0 0 56 VBottom 2
WINDOW 3 32 56 VTop 2
SYMATTR InstName R36
SYMATTR Value 5k
SYMBOL res 752 4832 R180
WINDOW 0 36 76 Left 2
WINDOW 3 36 40 Left 2
SYMATTR InstName R37
SYMATTR Value 1k
SYMBOL res 1216 4816 R180
WINDOW 0 36 76 Left 2
WINDOW 3 36 40 Left 2
SYMATTR InstName R38
SYMATTR Value 1k
SYMBOL res 2032 4832 R270
WINDOW 0 32 56 VTop 2
WINDOW 3 0 56 VBottom 2
SYMATTR InstName R39
SYMATTR Value 150
SYMBOL OpAmps\\LT1001 2208 4736 R0
SYMATTR InstName U16
SYMBOL res 2144 4576 M90
WINDOW 0 0 56 VBottom 2
WINDOW 3 32 56 VTop 2
SYMATTR InstName R40
SYMATTR Value 680
SYMBOL res 2032 4608 R270
WINDOW 0 32 56 VTop 2
WINDOW 3 0 56 VBottom 2
SYMATTR InstName R41
SYMATTR Value 330
SYMBOL OpAmps\\LT1001 80 4832 M180
SYMATTR InstName U17
SYMBOL OpAmps\\LT1001 5776 4992 M180
SYMATTR InstName U18
SYMBOL diode 3936 4752 R0
SYMATTR InstName D9
SYMATTR Value RB511VM-40
SYMBOL OpAmps\\LT1001 3808 4832 R0
SYMATTR InstName U19
SYMBOL res 3744 4592 M90
WINDOW 0 0 56 VBottom 2
WINDOW 3 32 56 VTop 2
SYMATTR InstName R42
SYMATTR Value 1k
SYMBOL res 3616 4864 M90
WINDOW 0 0 56 VBottom 2
WINDOW 3 32 56 VTop 2
SYMATTR InstName R43
SYMATTR Value 1k
SYMBOL diode 4160 4752 R0
SYMATTR InstName D10
SYMATTR Value RB511VM-40
SYMBOL diode 3936 4912 R0
SYMATTR InstName D11
SYMATTR Value RB511VM-40
SYMBOL schottky 4160 4912 R0
SYMATTR InstName D12
SYMATTR Value RB511VM-40
SYMATTR Description Diode
SYMATTR Type diode
SYMBOL res 4080 4448 M0
SYMATTR InstName R44
SYMATTR Value 500k
SYMBOL res 4080 5200 M0
SYMATTR InstName R45
SYMATTR Value 50k
SYMBOL diode 4400 4752 R0
SYMATTR InstName D13
SYMATTR Value RB511VM-40
SYMBOL diode 4624 4752 R0
SYMATTR InstName D14
SYMATTR Value RB511VM-40
SYMBOL diode 4400 4912 R0
SYMATTR InstName D15
SYMATTR Value RB511VM-40
SYMBOL schottky 4624 4912 R0
SYMATTR InstName D16
SYMATTR Value RB511VM-40
SYMATTR Description Diode
SYMATTR Type diode
SYMBOL res 4544 4448 M0
SYMATTR InstName R46
SYMATTR Value 500k
SYMBOL res 4544 5200 M0
SYMATTR InstName R47
SYMATTR Value 50k
SYMBOL OpAmps\\LT1001 5232 4864 R0
SYMATTR InstName U20
SYMBOL res 5168 4672 M90
WINDOW 0 0 56 VBottom 2
WINDOW 3 32 56 VTop 2
SYMATTR InstName R48
SYMATTR Value 1k
SYMBOL res 5168 5056 R180
WINDOW 0 36 76 Left 2
WINDOW 3 36 40 Left 2
SYMATTR InstName R49
SYMATTR Value 1k
SYMBOL res 4944 4656 R90
WINDOW 0 0 56 VBottom 2
WINDOW 3 32 56 VTop 2
SYMATTR InstName R50
SYMATTR Value 5k
SYMBOL res 4960 5104 R90
WINDOW 0 0 56 VBottom 2
WINDOW 3 32 56 VTop 2
SYMATTR InstName R51
SYMATTR Value 5k
SYMBOL res 5040 4592 R90
WINDOW 0 0 56 VBottom 2
WINDOW 3 32 56 VTop 2
SYMATTR InstName R52
SYMATTR Value 5k
SYMBOL res 5056 5168 R90
WINDOW 0 0 56 VBottom 2
WINDOW 3 32 56 VTop 2
SYMATTR InstName R53
SYMATTR Value 5k
SYMBOL res 4080 4944 R180
WINDOW 0 36 76 Left 2
WINDOW 3 36 40 Left 2
SYMATTR InstName R54
SYMATTR Value 1k
SYMBOL res 4544 4928 R180
WINDOW 0 36 76 Left 2
WINDOW 3 36 40 Left 2
SYMATTR InstName R55
SYMATTR Value 1k
SYMBOL res 5328 4944 R270
WINDOW 0 32 56 VTop 2
WINDOW 3 0 56 VBottom 2
SYMATTR InstName R56
SYMATTR Value 150
SYMBOL OpAmps\\LT1001 5504 4848 R0
SYMATTR InstName U21
SYMBOL res 5440 4672 M90
WINDOW 0 0 56 VBottom 2
WINDOW 3 32 56 VTop 2
SYMATTR InstName R57
SYMATTR Value 680
SYMBOL res 5616 4928 R270
WINDOW 0 32 56 VTop 2
WINDOW 3 0 56 VBottom 2
SYMATTR InstName R58
SYMATTR Value 150
SYMBOL res 5408 4496 R0
SYMATTR InstName R59
SYMATTR Value 330
SYMBOL OpAmps\\LT1001 -352 4576 M180
SYMATTR InstName U22
SYMBOL OpAmps\\LT1001 10928 1280 R0
SYMATTR InstName U124
SYMBOL res 10784 1568 R180
WINDOW 0 36 76 Left 2
WINDOW 3 36 40 Left 2
SYMATTR InstName R365
SYMATTR Value 1k
SYMBOL res 10704 1344 R90
WINDOW 0 0 56 VBottom 2
WINDOW 3 32 56 VTop 2
SYMATTR InstName R366
SYMATTR Value 1k
SYMBOL res 10576 1264 R90
WINDOW 0 0 56 VBottom 2
WINDOW 3 32 56 VTop 2
SYMATTR InstName R367
SYMATTR Value 1k
SYMBOL res 11056 1184 R90
WINDOW 0 0 56 VBottom 2
WINDOW 3 32 56 VTop 2
SYMATTR InstName R368
SYMATTR Value 1k
SYMBOL OpAmps\\LT1001 11264 1424 M180
SYMATTR InstName U125
SYMBOL res 10096 1056 R270
WINDOW 0 32 56 VTop 2
WINDOW 3 0 56 VBottom 2
SYMATTR InstName R369
SYMATTR Value 20k
SYMBOL cap 10240 1056 R270
WINDOW 0 32 32 VTop 2
WINDOW 3 0 32 VBottom 2
SYMATTR InstName C9
SYMATTR Value 500n
SYMBOL OpAmps\\LT1001 10320 1344 M180
SYMATTR InstName U126
SYMBOL res 11408 1344 R0
SYMATTR InstName R370
SYMATTR Value 7K
SYMBOL res 11408 1488 R0
SYMATTR InstName R371
SYMATTR Value 1K
SYMBOL voltage 1312 560 R0
WINDOW 123 0 0 Left 0
WINDOW 39 0 0 Left 0
SYMATTR InstName Vdd3
SYMATTR Value 3.3
SYMBOL bv 10432 1552 R0
SYMATTR InstName B1
SYMATTR Value V=V(VIN)*V(VIN)
TEXT -96 -40 Left 2 !.tran 1
TEXT -96 -256 Left 2 !.option noopiter
TEXT -344 1696 Left 2 !.param LR=1k
TEXT -344 1736 Left 2 !.param LRB=1K
TEXT -344 1776 Left 2 !.param c=1u

The netlist it stands for:
* OZ_8_bounded_curves.asc
vtemp1 Vint 0 0.45
Vdd1 VDD 0 3.3
V1 VSS- 0 -10
V2 VSS+ 0 10
voff1 VOFFSET 0 1
voff2 VREF 0 1
voff3 vw 0 2.4
Vdd2 VGND 0 0
XU1 VGND N005 VSS+ VSS- N006 LT1001  ; pins In+ In- V+ V- OUT
R10 N006 N005 1k
R11 N005 N011 1k
XU2 VGND N007 VSS+ VSS- N008 LT1001  ; pins In+ In- V+ V- OUT
R12 N008 N007 1k
R13 N007 N006 1k
R14 N007 VOFFSET 1k
XU3 VGND N009 VSS+ VSS- N010 LT1001  ; pins In+ In- V+ V- OUT
R15 N010 N009 1.65k
R16 N009 N008 1k
XU4 VGND N013 VSS+ VSS- N014 LT1001  ; pins In+ In- V+ V- OUT
R17 N014 N013 1k
R18 N013 N011 1k
R19 N013 VOFFSET 1k
XU5 VGND N015 VSS+ VSS- N016 LT1001  ; pins In+ In- V+ V- OUT
R20 N016 N015 1.65k
R21 N015 N014 1k
XU6 VIN N011 VSS+ VSS- N011 LT1001  ; pins In+ In- V+ V- OUT
XU7 N010 VPOS VSS+ VSS- VPOS LT1001  ; pins In+ In- V+ V- OUT
XU8 N016 VNEG VSS+ VSS- VNEG LT1001  ; pins In+ In- V+ V- OUT
MW1 N003 vw N002 N002 PMOS
Csyn1 N003 0 10n V=4 Irms=162m Rser=0.395426 Lser=0 mfg="KEMET" pn="C0402C103K7PAC" type="X5R" IC=0
Ck1 SPIKES1 0 10n
MPNOT1 N001 N003 VDD VDD PMOS
MNNOT1 N001 N003 0 0 NMOS
MVREF1 N004 VREF 0 0 NMOS
MREF1 N003 SPIKES1 0 0 NMOS
MVLK1 N003 V0 0 0 NMOS
MINA1 N003 N001 VDD VDD PMOS
MIN1 N002 VPOS VDD VDD PMOS
MPNOT2 SPIKES1 N001 VDD VDD PMOS
MNNOT2 SPIKES1 N001 N004 N004 NMOS
M1 VDD SPIKES1 VOUT1 VOUT1 NMOS
M2 VOUT1 Vint 0 0 NMOS
Cint1 VOUT1 0 0.1µ
V3 V0 0 757m
R1 V0 v1 10k
R2 v1 v2 10k
R3 v2 v3 10k
R4 v4 0 595k
R5 v3 v4 10k
V4 VIN 0 SINE(0 1 1.5 0 0 0 120)
XU121 N019 OUTPUT VSS+ VSS- OUTPUT LT1001  ; pins In+ In- V+ V- OUT
XU122 VGND N012 VSS+ VSS- N017 LT1001  ; pins In+ In- V+ V- OUT
R354 N017 N012 1k
XU123 VGND N018 VSS+ VSS- N019 LT1001  ; pins In+ In- V+ V- OUT
R355 N018 N019 1k
R356 N017 N018 1k
R357 N012 T1 1k
M17 N060 Wc N051 N060 NMOS
C1 N060 VGND {C} IC=0
XU9 VGND N052 VSS+ VSS- N053 LT1001  ; pins In+ In- V+ V- OUT
R6 N053 N052 1k
R7 N052 N037 1k
R8 N052 N057 1k
XU10 VGND N050 VSS+ VSS- N051 LT1001  ; pins In+ In- V+ V- OUT
R9 N050 N051 1k
R22 N053 N050 1k
XU11 N060 N057 VSS+ VSS- N057 LT1001  ; pins In+ In- V+ V- OUT
XU12 N060 N028 VSS+ VSS- N028 LT1001  ; pins In+ In- V+ V- OUT
R23 N031 N048 {LRB}
R24 N048 VGND {LR}
XU13 ERRORSIG N049 VSS+ VSS- N049 LT1001  ; pins In+ In- V+ V- OUT
D1 N034 N033 RB511VM-40
XU14 VGND N032 VSS+ VSS- N033 LT1001  ; pins In+ In- V+ V- OUT
R25 N032 N033 1k
R26 N027 N032 1k
D2 N034 N049 RB511VM-40
D3 N033 N055 RB511VM-40
D4 N049 N055 RB511VM-40
R27 VDD N034 500k
R28 N055 VGND 50k
D5 N029 N049 RB511VM-40
D6 N029 N027 RB511VM-40
D7 N049 N056 RB511VM-40
D8 N027 N056 RB511VM-40
R29 VDD N029 500k
R30 N056 VGND 50k
XU15 N030 N035 VSS+ VSS- N038 LT1001  ; pins In+ In- V+ V- OUT
R31 N035 N038 1k
R32 VGND N030 1k
R33 N035 N034 5k
R34 N035 N056 5k
R35 N030 N029 5k
R36 N030 N055 5k
R37 N055 N034 1k
R38 N056 N029 1k
R39 N038 N054 150
XU16 N054 N036 VSS+ VSS- N037 LT1001  ; pins In+ In- V+ V- OUT
R40 N036 N037 680
R41 VGND N036 330
XU17 N048 N027 VSS+ VSS- N027 LT1001  ; pins In+ In- V+ V- OUT
XU18 N058 T1 VSS+ VSS- T1 LT1001  ; pins In+ In- V+ V- OUT
D9 N043 N040 RB511VM-40
XU19 VGND N039 VSS+ VSS- N040 LT1001  ; pins In+ In- V+ V- OUT
R42 N039 N040 1k
R43 N028 N039 1k
D10 N043 N031 RB511VM-40
D11 N040 N061 RB511VM-40
D12 N031 N061 RB511VM-40
R44 VDD N043 500k
R45 N061 VGND 50k
D13 N041 N031 RB511VM-40
D14 N041 N028 RB511VM-40
D15 N031 N062 RB511VM-40
D16 N028 N062 RB511VM-40
R46 VDD N041 500k
R47 N062 VGND 50k
XU20 N042 N044 VSS+ VSS- N045 LT1001  ; pins In+ In- V+ V- OUT
R48 N044 N045 1k
R49 VGND N042 1k
R50 N044 N043 5k
R51 N044 N062 5k
R52 N042 N041 5k
R53 N042 N061 5k
R54 N061 N043 1k
R55 N062 N041 1k
R56 N045 N059 150
XU21 N059 N046 VSS+ VSS- N047 LT1001  ; pins In+ In- V+ V- OUT
R57 N046 N047 680
R58 N047 N058 150
R59 VGND N046 330
XU22 VOUT1 N031 VSS+ VSS- N031 LT1001  ; pins In+ In- V+ V- OUT
XU124 N025 N021 VSS+ VSS- N022 LT1001  ; pins In+ In- V+ V- OUT
R365 VGND N025 1k
R366 N025 N024 1k
R367 N021 N023 1k
R368 N022 N021 1k
XU125 N022 N026 VSS+ VSS- N026 LT1001  ; pins In+ In- V+ V- OUT
R369 OUTPUT N020 20k
C9 N020 VGND 500n
XU126 N020 N023 VSS+ VSS- N023 LT1001  ; pins In+ In- V+ V- OUT
R370 N026 ERRORSIG 7K
R371 ERRORSIG 0 1K
Vdd3 Wc 0 3.3
B1 N024 0 V=V(VIN)*V(VIN)
.model D D
.lib standard.dio
.model NMOS NMOS
.model PMOS PMOS
.lib standard.mos
.tran 1
.option noopiter
.param LR=1k
.param LRB=1K
.param c=1u
.lib LTC.lib
.backanno
.end